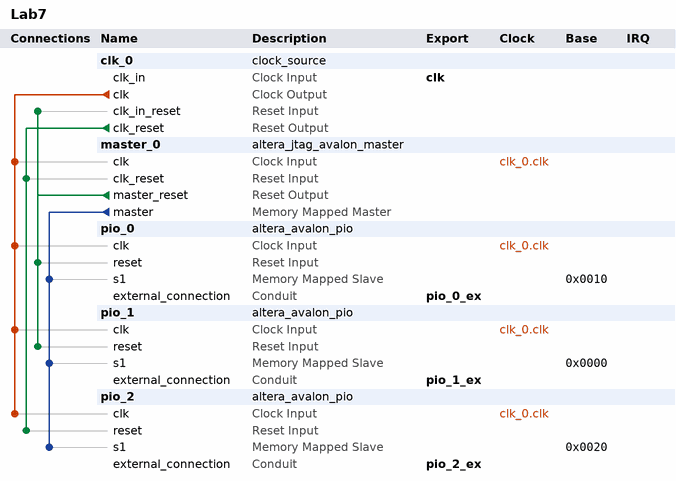
[diagram p0: system contents]
# Platform Designer (Qsys) system Lab7, Cyclone V 5CSXFC6D6F31C6
# Parameters at their usual value, and those the tool derives, are not listed.
package require -exact qsys 20.1
create_system Lab7
set_project_property DEVICE_FAMILY {Cyclone V}
set_project_property DEVICE 5CSXFC6D6F31C6

add_instance clk_0 clock_source 20.1
set_instance_parameter_value clk_0 clockFrequency 50000000

add_instance master_0 altera_jtag_avalon_master 20.1

add_instance pio_0 altera_avalon_pio 20.1
set_instance_parameter_value pio_0 direction Output
set_instance_parameter_value pio_0 width 8

add_instance pio_1 altera_avalon_pio 20.1
set_instance_parameter_value pio_1 direction InOut
set_instance_parameter_value pio_1 width 1

add_instance pio_2 altera_avalon_pio 20.1
set_instance_parameter_value pio_2 direction Input
set_instance_parameter_value pio_2 width 10

# connections
add_connection clk_0.clk master_0.clk clock
add_connection clk_0.clk pio_0.clk clock
add_connection clk_0.clk pio_1.clk clock
add_connection clk_0.clk pio_2.clk clock
add_connection clk_0.clk_reset master_0.clk_reset reset
add_connection clk_0.clk_reset pio_2.reset reset
add_connection master_0.master_reset clk_0.clk_in_reset reset
add_connection master_0.master_reset pio_0.reset reset
add_connection master_0.master_reset pio_1.reset reset
add_connection master_0.master pio_0.s1 avalon
set_connection_parameter_value master_0.master/pio_0.s1 baseAddress 0x0010
add_connection master_0.master pio_1.s1 avalon
set_connection_parameter_value master_0.master/pio_1.s1 baseAddress 0x0000
add_connection master_0.master pio_2.s1 avalon
set_connection_parameter_value master_0.master/pio_2.s1 baseAddress 0x0020

# exported interfaces
add_interface clk clock sink
set_interface_property clk EXPORT_OF clk_0.clk_in
add_interface pio_0_ex conduit end
set_interface_property pio_0_ex EXPORT_OF pio_0.external_connection
add_interface pio_1_ex conduit end
set_interface_property pio_1_ex EXPORT_OF pio_1.external_connection
add_interface pio_2_ex conduit end
set_interface_property pio_2_ex EXPORT_OF pio_2.external_connection

set_interconnect_requirement {$system} qsys_mm.clockCrossingAdapter HANDSHAKE
set_interconnect_requirement {$system} qsys_mm.enableEccProtection FALSE
set_interconnect_requirement {$system} qsys_mm.insertDefaultSlave FALSE
set_interconnect_requirement {$system} qsys_mm.maxAdditionalLatency 1

save_system Lab7.qsys
